# Altium project PCB_Project.PrjPcb
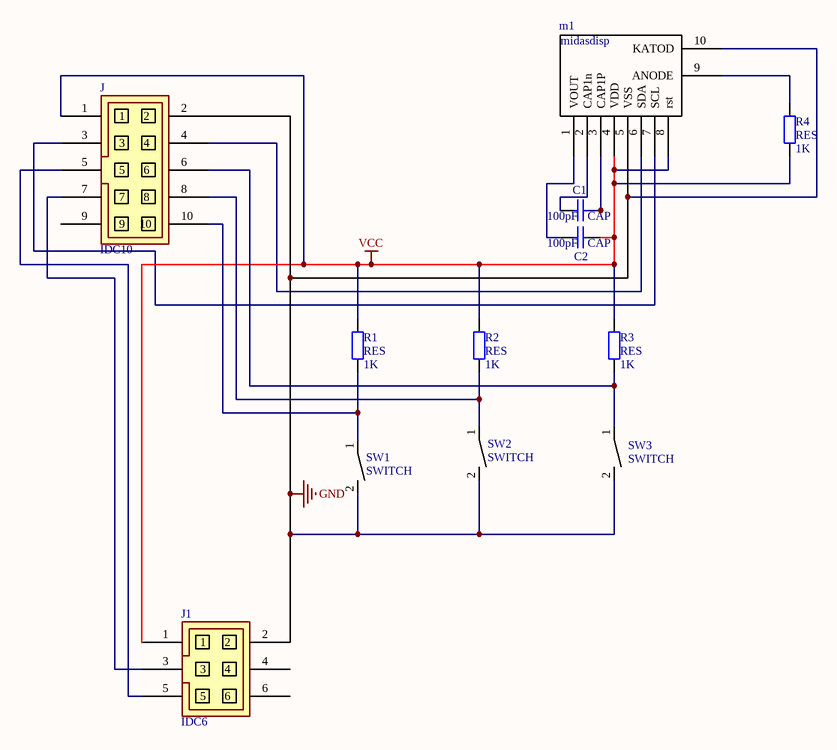
[diagram p0: displaykort.SchDoc]
1 sheet, 12 parts. Net scope: global (net labels, ports and power ports of the same name join across sheets).
Board file: displaykort.PcbDoc

## Sheet displaykort.SchDoc
size A4

### Parts
C1  CAP  value 100pF  [CAPC2012X11M]
C2  CAP  value 100pF  [CAPC2012X11M]
J  IDC10  [IDC10]
J1  IDC6  [IDC6]
m1  midasdisp  [PCBComponent_1]
R1  RES  value 1K  [RESC2012X07M]
R2  RES  value 1K  [RESC2012X07M]
R3  RES  value 1K  [RESC2012X07M]
R4  RES  value 1K  [RESC2012X07M]
SW1  SWITCH  [Switch_pad]
SW2  SWITCH  [Switch_pad]
SW3  SWITCH  [Switch_pad]

### Nets
GND: J.2 J1.2 m1.5(VSS) m1.10(KATOD) SW1.2 SW2.2 SW3.2
VCC: C2.2 J.1 J1.1 m1.4(VDD) m1.8(rst) R1.2 R2.2 R3.2 R4.1
NetC1_1: C1.1 m1.2(CAP1n)
NetC1_2: C1.2 m1.3(CAP1P)
NetC2_1: C2.1 m1.1(VOUT)
NetJ_3: J.3 m1.7(SCL)
NetJ_4: J.4 m1.6(SDA)
NetJ_5: J.5 J1.5
NetJ_6: J.6 R3.1 SW3.1
NetJ_7: J.7 J1.3
NetJ_8: J.8 R2.1 SW2.1
NetJ_10: J.10 R1.1 SW1.1
Netm1_9: m1.9(ANODE) R4.2

Not connected (* = marked no-connect by the designer): J 9; J1 4 6

### Library data of the parts
C1 C2 = CAP: Capacitor; Published: 8-Jun-2000; LatestRevisionDate: 17-Jul-2002; LatestRevisionNote: Re-released for DXP Platform.; PackageReference: RB7.6-15; Publisher: Altium Limited; PackageDescription: Polarized Capacitor (Radial); 2 Leads
J = IDC10: 10pin IDC connector
J1 = IDC6: 6pin IDC connector
R1-R4 = RES: Resistor; Published: 8-Jun-2000; LatestRevisionDate: 17-Jul-2002; LatestRevisionNote: Re-released for DXP Platform.; PackageReference: AXIAL-0.4; Publisher: Altium Limited; PackageDescription: Axial Device, Thru-Hole; 2 Leads; 0.4 in Pin Spacing